# Altium schematic sheet BPC_PWR_MCU.schdoc: Eurocard VME 6U (9.187 x 6.299 inches)
size A3; Organization: Organization; Address1: Address1; Address2: Address2; Address3: Address3; Address4: Address4; DocumentNumber: 1; Revision: 0; SheetNumber: 4; SheetTotal: 5
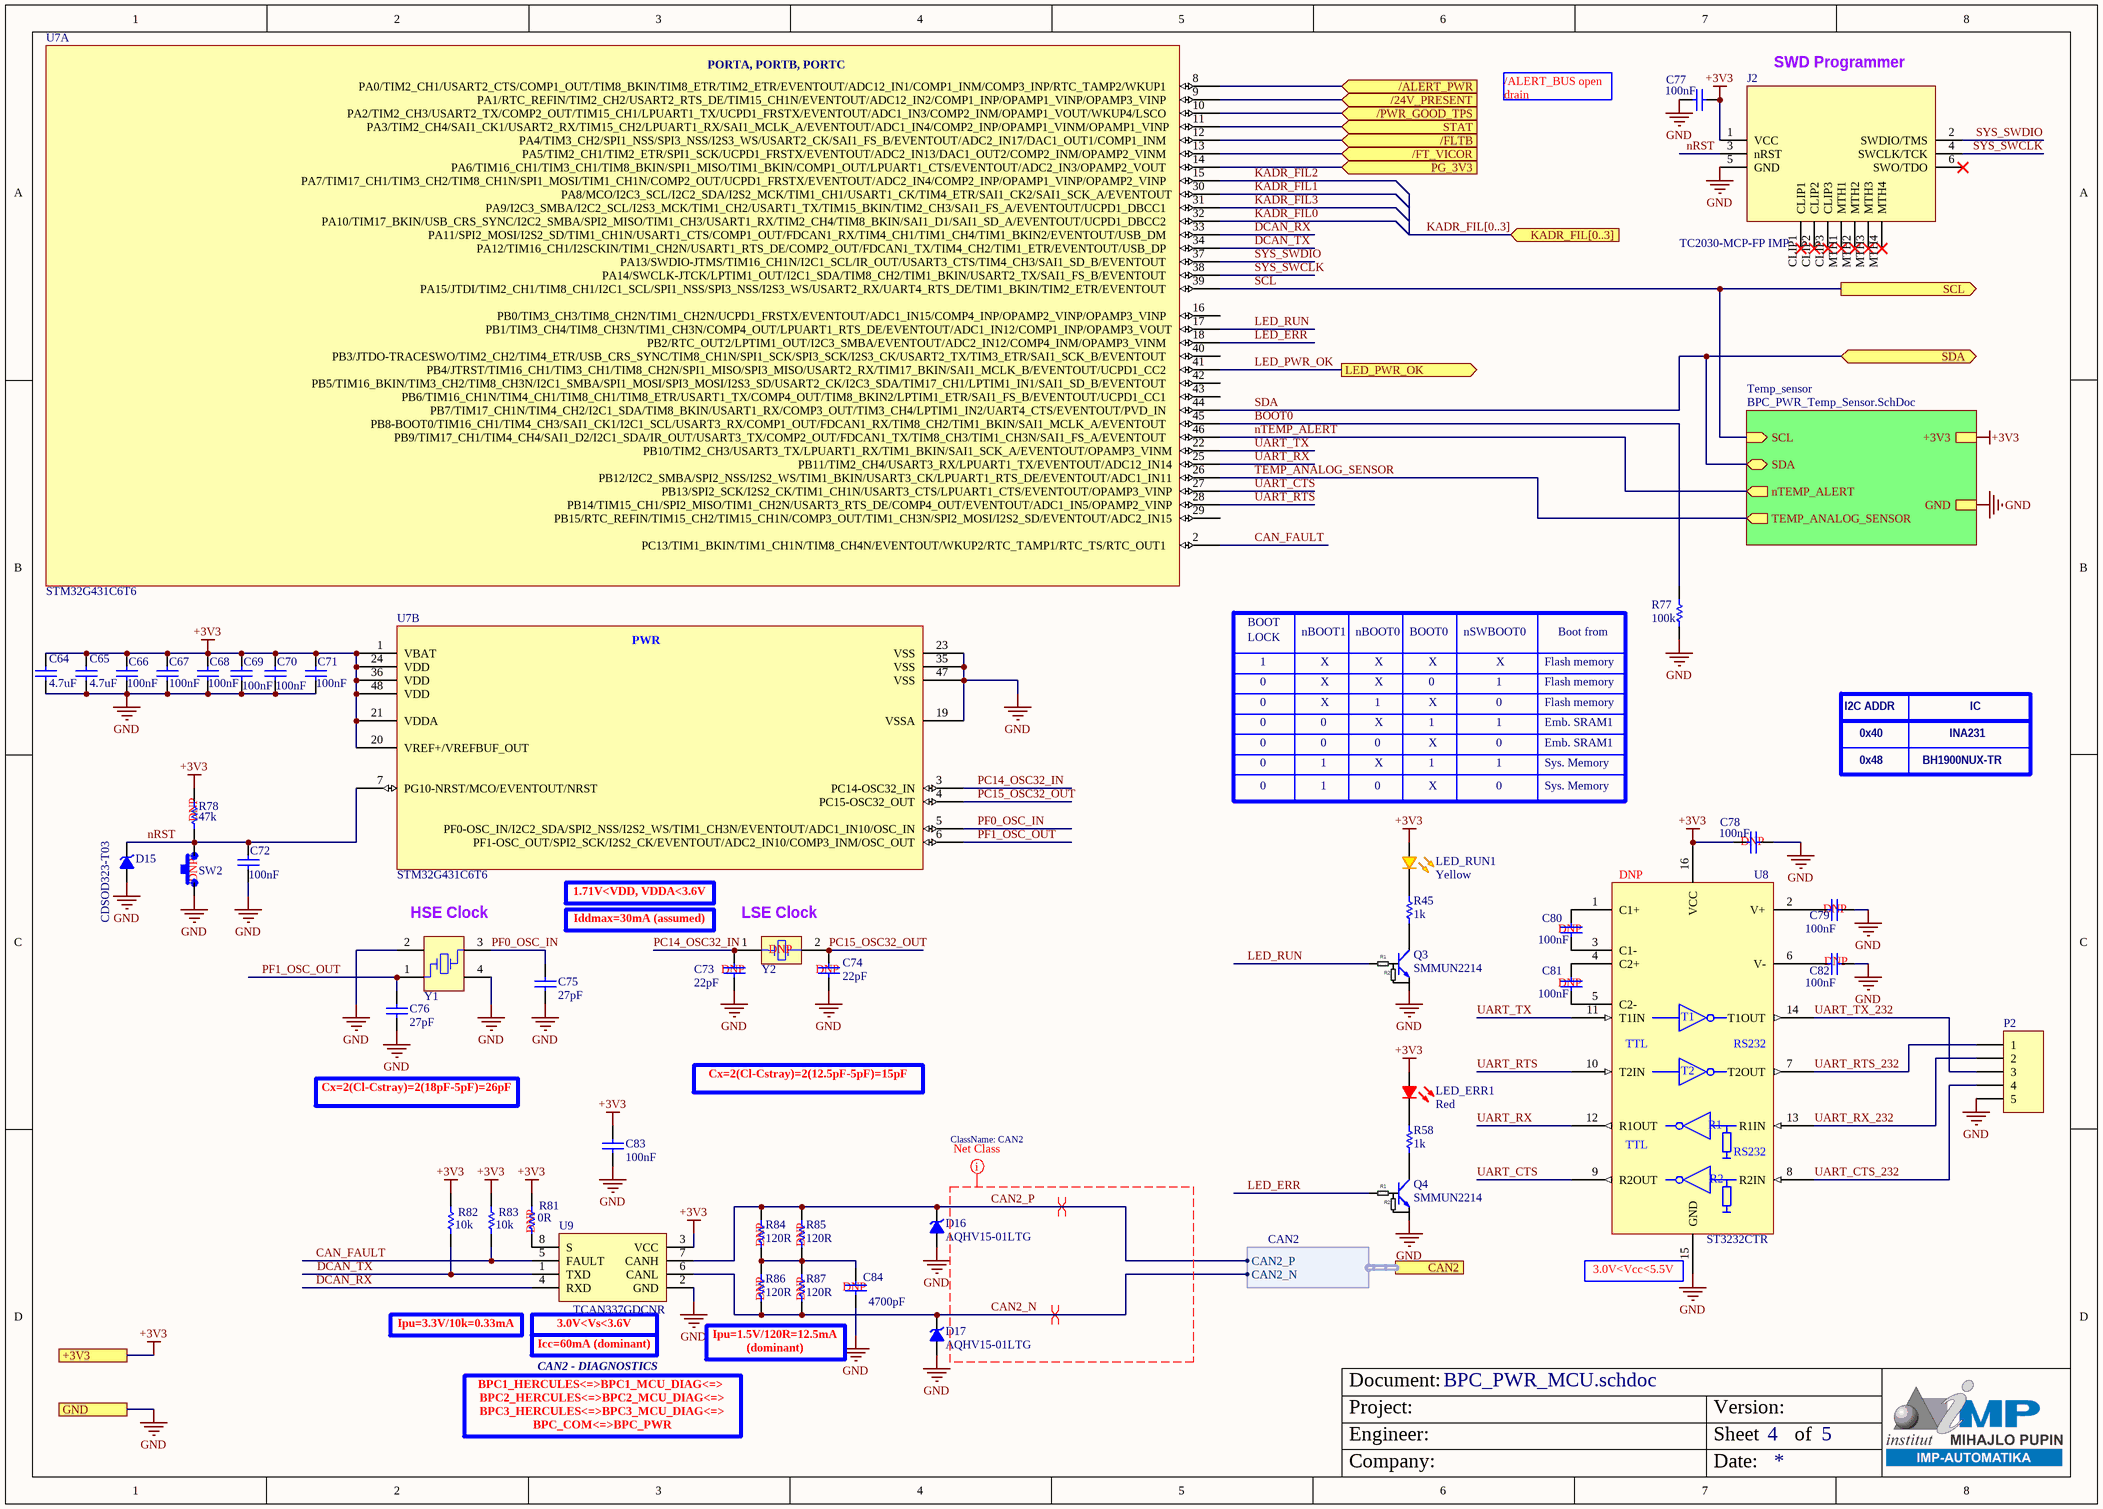
[diagram p0: BPC_PWR_MCU.schdoc]

## Parts
C64  DB Parameter 1: 4.7uF  [C0603L 0.8 MM MS]  (hidden comment: Ceramic Capacitor)
C65  DB Parameter 1: 4.7uF  [C0603L 0.8 MM MS]  (hidden comment: Ceramic Capacitor)
C66  Capacitance: 100nF  [C0603L 0.8 MM MS]  (hidden comment: Ceramic Capacitor)
C67  Capacitance: 100nF  [C0603L 0.8 MM MS]  (hidden comment: Ceramic Capacitor)
C68  Capacitance: 100nF  [C0603L 0.8 MM MS]  (hidden comment: Ceramic Capacitor)
C69  Capacitance: 100nF  [C0603L 0.8 MM MS]  (hidden comment: Ceramic Capacitor)
C70  Capacitance: 100nF  [C0603L 0.8 MM MS]  (hidden comment: Ceramic Capacitor)
C71  Capacitance: 100nF  [C0603L 0.8 MM MS]  (hidden comment: Ceramic Capacitor)
C72  Capacitance: 100nF  [C0603L 0.8 MM MS]  (hidden comment: Ceramic Capacitor)
C73  Populated: DNP  Capacitance: 22pF  [C0603L 0.8 MM MS]  (hidden comment: Ceramic Capacitor)
C74  Populated: DNP  Capacitance: 22pF  [C0603L 0.8 MM MS]  (hidden comment: Ceramic Capacitor)
C75  Capacitance: 27pF  [C0603L 0.8 MM MS]  (hidden comment: Ceramic Capacitor)
C76  Capacitance: 27pF  [C0603L 0.8 MM MS]  (hidden comment: Ceramic Capacitor)
C77  Capacitance: 100nF  [C0603L 0.8 MM MS]  (hidden comment: Ceramic Capacitor)
C78  Populated: DNP  Capacitance: 100nF  [C0603L 0.8 MM MS]  (hidden comment: Ceramic Capacitor)
C79  Populated: DNP  Capacitance: 100nF  [C0603L 0.8 MM MS]  (hidden comment: Ceramic Capacitor)
C80  Populated: DNP  Capacitance: 100nF  [C0603L 0.8 MM MS]  (hidden comment: Ceramic Capacitor)
C81  Populated: DNP  Capacitance: 100nF  [C0603L 0.8 MM MS]  (hidden comment: Ceramic Capacitor)
C82  Populated: DNP  Capacitance: 100nF  [C0603L 0.8 MM MS]  (hidden comment: Ceramic Capacitor)
C83  Capacitance: 100nF  [C0603L 0.8 MM MS]  (hidden comment: Ceramic Capacitor)
C84  Populated: DNP  Capacitance: 4700pF  [C0603L 0.8 MM MS]  (hidden comment: Ceramic Capacitor)
D15  CDSOD323-T03  [SOD2513X114N]
D16  AQHV15-01LTG  [AQHV1501LTGC SOD523 MS]
D17  AQHV15-01LTG  [AQHV1501LTGC SOD523 MS]
J2  TC2030-MCP-FP IMP  [TC2030-MCP-FP MS]
LED_ERR1  Red  [LED Red Mentor 2632.8320 x1]
LED_RUN1  Yellow  [LED Yellow Mentor 2632.8370 x1 MS]
P2  Header  [Header 1x5 2.54 12.4/3mm SL 11 124 5 G MS]  (value not drawn)
Q3  SMMUN2214  [SOT-23 MS]
Q4  SMMUN2214  [SOT-23 MS]
R45  Resistance: 1k  [R0603L 0.45MM MS]  (hidden comment: Resistor)
R58  Resistance: 1k  [R0603L 0.45MM MS]  (hidden comment: Resistor)
R77  Resistance: 100k  [R0603L 0.45MM MS]  (hidden comment: Resistor)
R78  Populated: DNP  Resistance: 47k  [R0603L 0.45MM MS]  (hidden comment: Resistor)
R81  Populated: DNP  Resistance: 0R  [R0603L 0.45MM MS]  (hidden comment: Resistor)
R82  Resistance: 10k  [R0603L 0.45MM MS]  (hidden comment: Resistor)
R83  Resistance: 10k  [R0603L 0.45MM MS]  (hidden comment: Resistor)
R84  Populated: DNP  Resistance: 120R  [0805 R 0.5mm MS]  (hidden comment: Resistor)
R85  Populated: DNP  Resistance: 120R  [0805 R 0.5mm MS]  (hidden comment: Resistor)
R86  Populated: DNP  Resistance: 120R  [0805 R 0.5mm MS]  (hidden comment: Resistor)
R87  Populated: DNP  Resistance: 120R  [0805 R 0.5mm MS]  (hidden comment: Resistor)
SW2  Populated: DNP  [ADTSM3 MS]  (hidden comment: Tactile Switch)
U7  STM32G431C6T6  [LQFP48-7x7mm MS]  (parts A,B of 2)
U8  Populated: DNP  [TSSOP16_STM MS]  (hidden comment: ST3232CTR)
U9  TCAN337GDCNR  [SOT65P280X110-8N]
Y1  Crystal  [ABMM2]  (value not drawn)
Y2  Populated: DNP  [ABS07W32768kHzD2T]  (hidden comment: Crystal)

## Sub-sheets
Temp_sensor = BPC_PWR_Temp_Sensor.SchDoc: GND, +3V3, nTEMP_ALERT (out), TEMP_ANALOG_SENSOR (out), SDA (bidir), SCL (in)

## Ports
+3V3, /24V_PRESENT (in), /ALERT_PWR (in), /FLTB (in), /FT_VICOR (in), /PWR_GOOD_TPS (in), CAN2 (harness CAN2), GND, KADR_FIL[0..3] (in), LED_PWR_OK (out), PG_3V3 (in), SCL (out), SDA (bidir), STAT (in)

## Harnesses
CAN2: CAN2_N, CAN2_P

## Nets
+3V3: C64.1 C65.1 C66.2 C67.2 C68.2 C69.2 C70.2 C71.2 C77.1 C78.2 C83.1 J2.1(VCC) LED_ERR1.A LED_RUN1.A R78.2 R81.2 R82.1 R83.1 U7.1(VBAT) U7.20(VREF+/VREFBUF_OUT) U7.21(VDDA) U7.24(VDD) U7.36(VDD) U7.48(VDD) U8.16(VCC) U9.3(VCC) ; port +3V3, sheet Temp_sensor/+3V3
GND: C64.2 C65.2 C66.1 C67.1 C68.1 C69.1 C70.1 C71.1 C72.1 C73.2 C74.2 C75.2 C76.2 C77.2 C78.1 C79.1 C82.1 C83.2 C84.2 D15.A D16.2(A) D17.2(A) J2.5(GND) P2.5 Q3.2 Q4.2 R77.2 SW2.1 U7.19(VSSA) U7.23(VSS) U7.35(VSS) U7.47(VSS) U8.15(GND) U9.2(GND) Y1.2(COM) Y1.4(OSC2) ; port GND, sheet Temp_sensor/GND
/24V_PRESENT: U7.9(PA1/RTC_REFIN/TIM2_CH2/USART2_RTS_DE/TIM15_CH1N/EVENTOUT/ADC12_IN2/COMP1_INP/OPAMP1_VINP/OPAMP3_VINP) ; port /24V_PRESENT
/ALERT_PWR: U7.8(PA0/TIM2_CH1/USART2_CTS/COMP1_OUT/TIM8_BKIN/TIM8_ETR/TIM2_ETR/EVENTOUT/ADC12_IN1/COMP1_INM/COMP3_INP/RTC_TAMP2/WKUP1) ; port /ALERT_PWR
/FLTB: U7.12(PA4/TIM3_CH2/SPI1_NSS/SPI3_NSS/I2S3_WS/USART2_CK/SAI1_FS_B/EVENTOUT/ADC2_IN17/DAC1_OUT1/COMP1_INM) ; port /FLTB
/FT_VICOR: U7.13(PA5/TIM2_CH1/TIM2_ETR/SPI1_SCK/UCPD1_FRSTX/EVENTOUT/ADC2_IN13/DAC1_OUT2/COMP2_INM/OPAMP2_VINM) ; port /FT_VICOR
/PWR_GOOD_TPS: U7.10(PA2/TIM2_CH3/USART2_TX/COMP2_OUT/TIM15_CH1/LPUART1_TX/UCPD1_FRSTX/EVENTOUT/ADC1_IN3/COMP2_INM/OPAMP1_VOUT/WKUP4/LSCO) ; port /PWR_GOOD_TPS
BOOT0: R77.1 U7.45(PB8-BOOT0/TIM16_CH1/TIM4_CH3/SAI1_CK1/I2C1_SCL/USART3_RX/COMP1_OUT/FDCAN1_RX/TIM8_CH2/TIM1_BKIN/SAI1_MCLK_A/EVENTOUT)
CAN2_N: D17.1(K) R86.1 R87.1 U9.6(CANL) ; port CAN2.CAN2_N
CAN2_P: D16.1(K) R84.2 R85.2 U9.7(CANH) ; port CAN2.CAN2_P
CAN_FAULT: R83.2 U7.2(PC13/TIM1_BKIN/TIM1_CH1N/TIM8_CH4N/EVENTOUT/WKUP2/RTC_TAMP1/RTC_TS/RTC_OUT1) U9.5(FAULT)
DCAN_RX: U7.33(PA11/SPI2_MOSI/I2S2_SD/TIM1_CH1N/USART1_CTS/COMP1_OUT/FDCAN1_RX/TIM4_CH1/TIM1_CH4/TIM1_BKIN2/EVENTOUT/USB_DM) U9.4(RXD)
DCAN_TX: R82.2 U7.34(PA12/TIM16_CH1/I2SCKIN/TIM1_CH2N/USART1_RTS_DE/COMP2_OUT/FDCAN1_TX/TIM4_CH2/TIM1_ETR/EVENTOUT/USB_DP) U9.1(TXD)
KADR_FIL0: U7.32(PA10/TIM17_BKIN/USB_CRS_SYNC/I2C2_SMBA/SPI2_MISO/TIM1_CH3/USART1_RX/TIM2_CH4/TIM8_BKIN/SAI1_D1/SAI1_SD_A/EVENTOUT/UCPD1_DBCC2)
KADR_FIL1: U7.30(PA8/MCO/I2C3_SCL/I2C2_SDA/I2S2_MCK/TIM1_CH1/USART1_CK/TIM4_ETR/SAI1_CK2/SAI1_SCK_A/EVENTOUT)
KADR_FIL2: U7.15(PA7/TIM17_CH1/TIM3_CH2/TIM8_CH1N/SPI1_MOSI/TIM1_CH1N/COMP2_OUT/UCPD1_FRSTX/EVENTOUT/ADC2_IN4/COMP2_INP/OPAMP1_VINP/OPAMP2_VINP)
KADR_FIL3: U7.31(PA9/I2C3_SMBA/I2C2_SCL/I2S3_MCK/TIM1_CH2/USART1_TX/TIM15_BKIN/TIM2_CH3/SAI1_FS_A/EVENTOUT/UCPD1_DBCC1)
LED_ERR: Q4.1 U7.18(PB2/RTC_OUT2/LPTIM1_OUT/I2C3_SMBA/EVENTOUT/ADC2_IN12/COMP4_INM/OPAMP3_VINM)
LED_PWR_OK: U7.41(PB4/JTRST/TIM16_CH1/TIM3_CH1/TIM8_CH2N/SPI1_MISO/SPI3_MISO/USART2_RX/TIM17_BKIN/SAI1_MCLK_B/EVENTOUT/UCPD1_CC2) ; port LED_PWR_OK
LED_RUN: Q3.1 U7.17(PB1/TIM3_CH4/TIM8_CH3N/TIM1_CH3N/COMP4_OUT/LPUART1_RTS_DE/EVENTOUT/ADC1_IN12/COMP1_INP/OPAMP3_VOUT)
nRST: C72.2 D15.K J2.3(nRST) R78.1 SW2.2 U7.7(PG10-NRST/MCO/EVENTOUT/NRST)
nTEMP_ALERT: U7.46(PB9/TIM17_CH1/TIM4_CH4/SAI1_D2/I2C1_SDA/IR_OUT/USART3_TX/COMP2_OUT/FDCAN1_TX/TIM8_CH3/TIM1_CH3N/SAI1_FS_A/EVENTOUT) ; sheet Temp_sensor/nTEMP_ALERT
PC14_OSC32_IN: C73.1 U7.3(PC14-OSC32_IN) Y2.1(OSC1)
PC15_OSC32_OUT: C74.1 U7.4(PC15-OSC32_OUT) Y2.2(COM)
PF0_OSC_IN: C75.1 U7.5(PF0-OSC_IN/I2C2_SDA/SPI2_NSS/I2S2_WS/TIM1_CH3N/EVENTOUT/ADC1_IN10/OSC_IN) Y1.3(COM)
PF1_OSC_OUT: C76.1 U7.6(PF1-OSC_OUT/SPI2_SCK/I2S2_CK/EVENTOUT/ADC2_IN10/COMP3_INM/OSC_OUT) Y1.1(OSC1)
PG_3V3: U7.14(PA6/TIM16_CH1/TIM3_CH1/TIM8_BKIN/SPI1_MISO/TIM1_BKIN/COMP1_OUT/LPUART1_CTS/EVENTOUT/ADC2_IN3/OPAMP2_VOUT) ; port PG_3V3
SCL: U7.39(PA15/JTDI/TIM2_CH1/TIM8_CH1/I2C1_SCL/SPI1_NSS/SPI3_NSS/I2S3_WS/USART2_RX/UART4_RTS_DE/TIM1_BKIN/TIM2_ETR/EVENTOUT) ; port SCL, sheet Temp_sensor/SCL
SDA: U7.44(PB7/TIM17_CH1N/TIM4_CH2/I2C1_SDA/TIM8_BKIN/USART1_RX/COMP3_OUT/TIM3_CH4/LPTIM1_IN2/UART4_CTS/EVENTOUT/PVD_IN) ; port SDA, sheet Temp_sensor/SDA
STAT: U7.11(PA3/TIM2_CH4/SAI1_CK1/USART2_RX/TIM15_CH2/LPUART1_RX/SAI1_MCLK_A/EVENTOUT/ADC1_IN4/COMP2_INP/OPAMP1_VINM/OPAMP1_VINP) ; port STAT
SYS_SWCLK: J2.4(SWCLK/TCK) U7.38(PA14/SWCLK-JTCK/LPTIM1_OUT/I2C1_SDA/TIM8_CH2/TIM1_BKIN/USART2_TX/SAI1_FS_B/EVENTOUT)
SYS_SWDIO: J2.2(SWDIO/TMS) U7.37(PA13/SWDIO-JTMS/TIM16_CH1N/I2C1_SCL/IR_OUT/USART3_CTS/TIM4_CH3/SAI1_SD_B/EVENTOUT)
TEMP_ANALOG_SENSOR: U7.26(PB12/I2C2_SMBA/SPI2_NSS/I2S2_WS/TIM1_BKIN/USART3_CK/LPUART1_RTS_DE/EVENTOUT/ADC1_IN11) ; sheet Temp_sensor/TEMP_ANALOG_SENSOR
UART_CTS: U7.27(PB13/SPI2_SCK/I2S2_CK/TIM1_CH1N/USART3_CTS/LPUART1_CTS/EVENTOUT/OPAMP3_VINP) U8.9(R2OUT)
UART_CTS_232: P2.4 U8.8(R2IN)
UART_RTS: U7.28(PB14/TIM15_CH1/SPI2_MISO/TIM1_CH2N/USART3_RTS_DE/COMP4_OUT/EVENTOUT/ADC1_IN5/OPAMP2_VINP) U8.10(T2IN)
UART_RTS_232: P2.1 U8.7(T2OUT)
UART_RX: U7.25(PB11/TIM2_CH4/USART3_RX/LPUART1_TX/EVENTOUT/ADC12_IN14) U8.12(R1OUT)
UART_RX_232: P2.2 U8.13(R1IN)
UART_TX: U7.22(PB10/TIM2_CH3/USART3_TX/LPUART1_RX/TIM1_BKIN/SAI1_SCK_A/EVENTOUT/OPAMP3_VINM) U8.11(T1IN)
UART_TX_232: P2.3 U8.14(T1OUT)
NetC79_2: C79.2 U8.2(V+)
NetC80_1: C80.1 U8.3(C1-)
NetC80_2: C80.2 U8.1(C1+)
NetC81_1: C81.1 U8.5(C2-)
NetC81_2: C81.2 U8.4(C2+)
NetC82_2: C82.2 U8.6(V-)
NetC84_1: C84.1 R84.1 R85.1 R86.2 R87.2
NetLED_ERR1_K: LED_ERR1.K R58.2
NetLED_RUN1_K: LED_RUN1.K R45.2
NetQ3_3: Q3.3 R45.1
NetQ4_3: Q4.3 R58.1
NetR81_1: R81.1 U9.8(S)

Not connected (* = marked no-connect by the designer): J2 6(SWO/TDO)* CLIP1* CLIP2* CLIP3* MTH1* MTH2* MTH3* MTH4*; U7 16(PB0/TIM3_CH3/TIM8_CH2N/TIM1_CH2N/UCPD1_FRSTX/EVENTOUT/ADC1_IN15/COMP4_INP/OPAMP2_VINP/OPAMP3_VINP__) 29(PB15/RTC_REFIN/TIM15_CH2/TIM15_CH1N/COMP3_OUT/TIM1_CH3N/SPI2_MOSI/I2S2_SD/EVENTOUT/ADC2_IN15) 40(PB3/JTDO-TRACESWO/TIM2_CH2/TIM4_ETR/USB_CRS_SYNC/TIM8_CH1N/SPI1_SCK/SPI3_SCK/I2S3_CK/USART2_TX/TIM3_ETR/SAI1_SCK_B/EVENTOUT__) 42(PB5/TIM16_BKIN/TIM3_CH2/TIM8_CH3N/I2C1_SMBA/SPI1_MOSI/SPI3_MOSI/I2S3_SD/USART2_CK/I2C3_SDA/TIM17_CH1/LPTIM1_IN1/SAI1_SD_B/EVENTOUT__) 43(PB6/TIM16_CH1N/TIM4_CH1/TIM8_CH1/TIM8_ETR/USART1_TX/COMP4_OUT/TIM8_BKIN2/LPTIM1_ETR/SAI1_FS_B/EVENTOUT/UCPD1_CC1__)

## Buses and harness runs
bus KADR_FIL[0..3] = port KADR_FIL[0..3]

## Layout directives
differential pair: CAN2_N, CAN2_P
net class CAN2: CAN2_N, CAN2_P

## Notes on the sheet
- /ALERT_BUS open drain
- SWD Programmer
- BOOT
- LOCK
- nBOOT1
- nBOOT0
- BOOT0
- nSWBOOT0
- Boot from
- 1
- 0
- X
- Flash memory
- I2C ADDR
- IC
- Emb. SRAM1
- Sys. Memory
- 0x40
- 0x48
- BH1900NUX-TR
- INA231
- (near Y1) HSE Clock
- 1.71V<VDD, VDDA<3.6V
- LSE Clock
- Iddmax=30mA (assumed)
- Cx=2(Cl-Cstray)=2(18pF-5pF)=26pF
- Cx=2(Cl-Cstray)=2(12.5pF-5pF)=15pF
- (near U8) 3.0V<Vcc<5.5V
- (near U9) Ipu=3.3V/10k=0.33mA (dominant)
- (near U9) 3.0V<Vs<3.6V
- (near U9) Icc=60mA (dominant)
- CAN2 - DIAGNOSTICS
- Ipu=1.5V/120R=12.5mA (dominant)
- BPC1_HERCULES<=>BPC1_MCU_DIAG<=>
  BPC2_HERCULES<=>BPC2_MCU_DIAG<=>
  BPC3_HERCULES<=>BPC3_MCU_DIAG<=>
  BPC_COM<=>BPC_PWR
  BPC2<=>BPC3<=>BPC_COM<=> BPC_PWR
- Document:
- Project:
- Engineer:
- Version:
- Sheet
- of
- Company:
- Date:
- (in symbol IC MCU STM32G431C6T6 MS, part A) PORTA, PORTB, PORTC
- (in symbol IC MCU STM32G431C6T6 MS, part B) PWR
- (in symbol IC ST3232CTR MS) T1; TTL; RS232; T2; R1; R2
- (in symbol Tra NPN Prebias MS) R1; R2

## Library data of the parts
C64 C65 = Cap Cer 4.7uF 10V X5R 0603 MS: Ceramic Capacitor 4.7uF 10V X5R 0603; Manufacturer: Samsung Electro-Mechanics; Manufacturer Part Number: CL10A475KP8NNNC; Tolerance: ±10%; Production Status: Active; Distributor: Mouser; Distributor Part Number: 187-CL10A475KP8NNNC; Last Revision Date: 19.10.2020.; Temperature Range: -55°C ~ +85°C; Mounting: SMD; ComponentLink1Description: Datasheet; ComponentLink1URL: https://eu.mouser.com/datasheet/2/585/MLCC-1837944.pdf; ComponentLink2Description: Distributor; ComponentLink2URL: https://eu.mouser.com/ProductDetail/Samsung-Electro-Mechanics/CL10A475KP8NNNC?qs=hqM3L16%252BxlfQRmkWsZz5vA%3D%3D; ComponentLink3Description: Manufacturer; ComponentLink3URL: http://product.samsungsem.com/mlcc/basic-search.do?partNumber=CL10A475KP8NNN; Status: Not Checked; Voltage: 10V; Dielectric: X5R; ComponentLink4Description: Charts; ComponentLink4URL: http://weblib.samsungsem.com/mlcc/mlcc-ec-data-sheet.do?partNumber=CL10A475KP8NNN; Capacitance: 4.7uF; DB Parameter 2: 10V; DB Parameter 3: X5R
C66-C72 C77-C83 = Cap Cer 100nF 50V X7R 0603 Pt02: Ceramic Capacitor 100nF 50V X7R 0603; Manufacturer: Samsung Electro-Mechanics; Manufacturer Part Number: CL10B104KB8WPNC; Tolerance: ±10%; Distributor: Mouser; Distributor Part Number: 187-CL10B104KB8WPNC; Last Revision Date: 19.10.2020.; Temperature Range: -55°C ~ +125°C; Mounting: SMD; ComponentLink1Description: Datasheet; ComponentLink1URL: https://eu.mouser.com/datasheet/2/396/mlcc02_e-1307760.pdf; ComponentLink2Description: Distributor; ComponentLink2URL: https://eu.mouser.com/ProductDetail/Taiyo-Yuden/JMK212BJ476MG-T?qs=I6KAKw0tg2zBfYZ1Prs1hQ%3D%3D; ComponentLink3Description: Manufacturer; ComponentLink3URL: https://ds.yuden.co.jp/TYCOMPAS/or/detail?pn=JMK212BBJ476MG-T&u=M; Status: Not Checked; Voltage: 50V; Dielectric: X7R; ComponentLink4Description: Charts; DB Parameter 1: 100nF; DB Parameter 2: 50V; DB Parameter 3: X7R
C73 C74 = Cap Cer 22pF 50V C0G_NP0 0603 MS: Ceramic Capacitor 22pF 50V C0G_NP0 0603; Manufacturer: AVX Corporation; Manufacturer Part Number: 06035A220JAT2A; Tolerance: ±5%; Dielectric: C0G, NP0; Production Status: Active; Distributor: Digi-Key; Distributor Part Number: 478-1167-1-ND; Last Revision Date: 13.07.2021; Temperature Range: -55°C ~ +125°C; Mounting: SMD; ComponentLink1Description: Datasheet; ComponentLink1URL: https://datasheets.avx.com/C0GNP0-Dielectric.pdf; ComponentLink2Description: Distributor; ComponentLink2URL: https://www.digikey.com/en/products/detail/avx-corporation/06035A220JAT2A/563277; ComponentLink3Description: Manufacturer; ComponentLink3URL: https://spicat.avx.com/product/mlcc/chartview/06035A220JAT2A/dist/mouser; Status: Not Checked; Voltage: 50V; ComponentLink4Description: Charts; ComponentLink4URL: https://spicat.avx.com/product/mlcc/chartview/06035A220JAT2A/dist/mouser; DB Parameter 1: 22pF; DB Parameter 2: 50V; DB Parameter 3: C0G, NP0
C75 C76 = Cap Cer 27pF 50V C0G_NP0 0603 MS: Ceramic Capacitor 27pF 50V C0G_NP0 0603; Manufacturer: Yageo; Manufacturer Part Number: CC0603JRNPO9BN270; Tolerance: ±5%; Dielectric: C0G, NP0; Production Status: Active; Distributor: Digi-Key; Distributor Part Number: 311-1063-1-ND; Last Revision Date: 07.06.2021; Temperature Range: -55°C ~ +125°C; Mounting: SMD; ComponentLink1Description: Datasheet; ComponentLink1URL: https://www.yageo.com/upload/media/product/productsearch/datasheet/mlcc/UPY-GP_NP0_16V-to-50V_18.pdf; ComponentLink2Description: Distributor; ComponentLink2URL: https://www.digikey.com/en/products/detail/yageo/CC0603JRNPO9BN270/302797; ComponentLink3Description: Manufacturer; ComponentLink3URL: https://www.yageo.com/en/ProductSearch/PartNumberSearch?part_number=CC0603JRNPO9BN270; Status: Not Checked; Voltage: 50V; ComponentLink4Description: Charts; ComponentLink4URL: https://www.yageo.com/en/Chart/Index/CC0603JRNPO9BN270#chart_cap_freq; DB Parameter 1: 27pF; DB Parameter 2: 50V; DB Parameter 3: C0G, NP0
C84 = Cap Cer 4700pF 50V C0G_NP0 0603 MS: Ceramic Capacitor 4700pF 50V C0G_NP0 0603; Manufacturer: TDK Corporation; Manufacturer Part Number: CGA3E2C0G1H472J080AA; Tolerance: ±5%; Dielectric: C0G, NP0; Production Status: Active; Distributor: Digi-Key; Distributor Part Number: 445-6912-1-ND; Last Revision Date: 26.06.2021; Temperature Range: -55°C ~ +125°C; Mounting: SMD; ComponentLink1Description: Datasheet; ComponentLink1URL: https://product.tdk.com/en/system/files?file=dam/doc/product/capacitor/ceramic/mlcc/catalog/mlcc_automotive_general_en.pdf; ComponentLink2Description: Distributor; ComponentLink2URL: https://www.digikey.com/en/products/detail/tdk-corporation/CGA3E2C0G1H472J080AA/2672805; ComponentLink3Description: Manufacturer; ComponentLink3URL: https://product.tdk.com/en/search/capacitor/ceramic/mlcc/info?part_no=CGA3E2C0G1H472J080AA; Status: Not Checked; Voltage: 50V; ComponentLink4Description: Charts; ComponentLink4URL: https://product.tdk.com/system/files/dam/doc/product/capacitor/ceramic/mlcc/charasheet/cga3e2c0g1h472j080aa.pdf; DB Parameter 1: 4700pF; DB Parameter 2: 50V; DB Parameter 3: C0G, NP0
D15 = Dio TVS Udir 3.3V 19V CDSOD323 MS: TVS Diode 3.3V 19V Udir; Manufacturer: Bourns Inc.; Peak Pulse Power: 350W; Production status: Active; Distributor: Digi-Key; Distributor Part Number: CDSOD323-T03CT-ND; Manufacturer Part Number: CDSOD323-T03; Last Revision Date: 29.03.2021; Temperature Range: -55°C ~ +155°C; Mounting: SMD; ComponentLink1Description: Datasheet; ComponentLink1URL: https://www.bourns.com/docs/Product-Datasheets/CDSOD323-TxxC.pdf; ComponentLink2Description: Distributor; ComponentLink2URL: https://www.digikey.com/en/products/detail/bourns-inc/CDSOD323-T03/3742076; ComponentLink3Description: Manufacturer; ComponentLink3URL: https://www.bourns.com/docs/Product-Datasheets/CDSOD323-TxxC.pdf; Status: Not Checked; Working Voltage: 3.3V; DB Parameter 1: 3.3V; DB Parameter 2: 19V; DB Parameter 3: 350W; Clamping Voltage: 19V
D16 D17 = Dio TVS Udir 15V 250W AQHV15-01LTG MS: TVS Diode 15V 300W Unidirectional; Manufacturer: Littelfuse Inc.; Peak Pulse Power: 250W; DB Parameter 1: 18.7V; DB Parameter 2: 21.5V; Production status: Active; Distributor: Mouser; Distributor Part Number: 576-AQHV15-01LTG; Manufacturer Part Number: AQHV15-01LTG; Last Revision Date: 09.06.2022; Temperature Range: -40°C ~ +150°C; Mounting: SMD; ComponentLink1Description: Datasheet; ComponentLink1URL: https://www.littelfuse.com/~/media/electronics/datasheets/tvs_diode_arrays/littelfuse_tvs_diode_array_aqhvxx_01ltg_datasheet.pdf.pdf; ComponentLink2Description: Distributor; ComponentLink2URL: https://eu.mouser.com/ProductDetail/Littelfuse/AQHV15-01LTG?qs=qSfuJ%252Bfl%2Fd4j4uT4lsIC5w%3D%3D; ComponentLink3Description: Manufacturer; ComponentLink3URL: https://www.littelfuse.com/~/media/electronics/datasheets/tvs_diode_arrays/littelfuse_tvs_diode_array_aqhvxx_01ltg_datasheet.pdf.pdf; Status: Not Checked; Working Voltage: 15V; DB Parameter 3: 250W; Clamping Voltage: 21.5V
J2 = Prog TC2030-MCP-FP IMP MS: PCB DECAL: TC2030-MCP-FP
LED_ERR1 = LED Mentor 2632.8320 Red x1 MS: LED Mentor 2632.8320 Red x1; Manufacturer Part Number: 2632.8320 1/8; Forward Current: 25mA; Luminous Intensity: 1.2 - 4 mcd; Forward Voltage: 2.25V; DB Parameter 3: 700nm; Production Status: Active; Distributor: Mentor; Distributor Part Number: 2632.8320 1/8; Manufacturer: Mentor; Last Revision Date: 17.03.2021; Temperature Range: -40°C ~ +85°C; Mounting: TH; ComponentLink1Description: Datasheet; ComponentLink1URL: https://www.mentor.de.com/productpdfs/opto/1145.pdf; ComponentLink2Description: Distributor; ComponentLink2URL: https://www.mentor.de.com/bauelemente/en/product/en-2632-8320/; ComponentLink3Description: Manufacturer; ComponentLink3URL: https://www.mentor.de.com/bauelemente/en/product/en-2632-8320/; Status: Not Checked; DB Parameter 1: Red; DB Parameter 2: 2.25V; LED Color: Red
LED_RUN1 = LED Mentor 2632.8370 Yellow x1 MS: LED Mentor 2632.8370 Yellow x1; Manufacturer Part Number: 2632.8370 1/8; Forward Current: 25mA; Luminous Intensity: 10 - 20 mcd; Forward Voltage: 2.1V; DB Parameter 3: 588nm; Production Status: Active; Distributor: Mentor; Distributor Part Number: 2632.8370 1/8; Manufacturer: Mentor; Last Revision Date: 31.08.2021; Temperature Range: -40°C ~ +85°C; Mounting: TH; ComponentLink1Description: Datasheet; ComponentLink1URL: https://www.mentor.de.com/productpdfs/opto/1145.pdf; ComponentLink2Description: Distributor; ComponentLink2URL: https://www.mentor.de.com/bauelemente/en/product/en-2632-8320/; ComponentLink3Description: Manufacturer; ComponentLink3URL: https://www.mentor.de.com/bauelemente/en/product/en-2632-8320/; Status: Not Checked; DB Parameter 1: Yellow; DB Parameter 2: 2.1V; LED Color: Yellow
P2 = Con Header 1x5 2.54 12.4/3mm Fischer SL 11 124 5 G: Header 1x5 2.54 12.4/3mm; Manufacturer: Fischer Elektronik; Rated Current: 3A; Distributor: Fischer Elektronik; Distributor Part Number: SL 11 124 5 G; Manufacturer Part Number: SL 11 124 5 G; Last Revision Date: 17.07.2020.; Temperature Range: -40°C ~ +163°C; Mounting: TH; ComponentLink1Description: Datasheet; ComponentLink1URL: https://www.fischerelektronik.com/web_fischer/en_GB/connectors/G01/Male%20headers/VA/SL111245G/index.xhtml; ComponentLink2Description: Distributor; ComponentLink2URL: https://www.fischerelektronik.com/web_fischer/en_GB/connectors/G01/Male%20headers/VA/SL111245G/index.xhtml; ComponentLink3Description: Manufacturer; ComponentLink3URL: https://www.fischerelektronik.com/web_fischer/en_GB/connectors/G01/Male%20headers/VA/SL111245G/index.xhtml; Status: Checked
Q3 Q4 = Tra NPN Prebias MS: TRANS PREBIAS NPN 50V SOT23; Manufacturer: ON Semiconductor; Manufacturer Part Number: SMMUN2214LT1G; Ic Max: 100mA; Resistor Base: 10k; Resistor Emitter Base: 47k; hFE Min: 80; Production Status: Active; Power Rating: 246mW; Vces: 0.25V; Distributor: Digi-Key; Distributor Part Number: SMMUN2214LT1GOSCT-ND; Last Revision Date: 29.07.2021; Temperature Range: -55°C ~ +150°C; Vcebo: 50V; Mounting: SMD; DB Parameter 1: 10k; DB Parameter 2: 47k; DB Parameter 3: 100mA; ComponentLink1Description: Datasheet; ComponentLink1URL: https://www.onsemi.com/pdf/datasheet/dtc114y-d.pdf; ComponentLink2Description: Distributor; ComponentLink2URL: https://www.digikey.com/en/products/detail/on-semiconductor/SMMUN2214LT1G/3062798; ComponentLink3Description: Manufacturer; ComponentLink3URL: https://www.onsemi.com/products/discretes-drivers/digital-transistors-brts/mmun2214l
R45 R58 = Res 1k 1% 125mW 0603: Resistor 1k 1% 125mW 0603; Manufacturer: Vishay Beyschlag/Draloric/BC Components; Manufacturer Part Number: MCT06030C1001FP500; Temperature Coefficient: ±50 PPM/°C; Production Status: Active; Distributor: Digi-Key; Distributor Part Number: MCT0603-1.00K-CFCT-ND; Last Revision Date: 22.10.2020.; Temperature Range: -55°C ~ +155°C; Mounting: SMD; ComponentLink1Description: Datasheet; ComponentLink1URL: https://www.vishay.com/docs/28705/mcx0x0xpro.pdf; ComponentLink2Description: Distributor; ComponentLink2URL: https://www.digikey.com/en/products/detail/vishay-beyschlag-draloric-bc-components/MCT06030C1001FP500/2607821; ComponentLink3Description: Manufacturer; ComponentLink3URL: https://www.vishay.com/search?query=MCT06030C1001FP500&searchChoice=part; Status: Not Checked; Power Rating: 125mW; Tolerance: ±1%; DB Parameter 2: ±1%; DB Parameter 3: 125mW; DB Parameter 1: 1k
R77 = Res 100k 1% 100mW 0603 Pt02: Resistor 100k 1% 100mW 0603; Manufacturer: Stackpole Electronics Inc; Manufacturer Part Number: RMCF0603FT100K; Temperature Coefficient: ±100ppm/°C; Production Status: Active; Distributor: Digi-Key; Distributor Part Number: RMCF0603FT100KCT-ND; Last Revision Date: 28.10.2020; Temperature Range: -55°C ~ +155°C; Mounting: SMD; ComponentLink1Description: Datasheet; ComponentLink1URL: https://www.seielect.com/catalog/sei-rmcf_rmcp.pdf; ComponentLink2Description: Distributor; ComponentLink2URL: https://www.digikey.com/en/products/detail/stackpole-electronics-inc/RMCF0603FT100K/1761112; ComponentLink3Description: Manufacturer; ComponentLink3URL: https://www.seielect.com/; Status: Not Checked; Power Rating: 100mW; Tolerance: ±1%; DB Parameter 1: 100k; DB Parameter 2: ±1%; DB Parameter 3: 100mW
R78 = Res 47k 1% 100mW 0603 MS: Resistor 47k 1% 100mW 0603; Manufacturer: Yageo; Manufacturer Part Number: RT0603FRE0747KL; Temperature Coefficient: ±50ppm/°C; Production Status: Active; Distributor: Digi-Key; Distributor Part Number: YAG3355CT-ND; Last Revision Date: 08.06.2021; Temperature Range: -55°C ~ +155°C; Mounting: SMD; ComponentLink1Description: Datasheet; ComponentLink1URL: https://www.yageo.com/upload/media/product/productsearch/datasheet/rchip/PYu-RT_1-to-0.01_RoHS_L_12.pdf; ComponentLink2Description: Distributor; ComponentLink2URL: https://www.digikey.com/en/products/detail/yageo/RT0603FRE0747KL/1075386; ComponentLink3Description: Manufacturer; ComponentLink3URL: https://www.yageo.com/en/ProductSearch/PartNumberSearch?part_number=RT0603FRE0747KL; Status: Not Checked; Power Rating: 100mW; Tolerance: ±1%; DB Parameter 1: 47k; DB Parameter 2: ±1%; DB Parameter 3: 100mW
R81 = Res 0R 100mW 0603: Resistor  0R 100mW 0603; Manufacturer: Stackpole Electronics Inc; Manufacturer Part Number: RMCF0603ZT0R00; DB Parameter 2: 1A; Production Status: Active; Maximum Current: 2A; Distributor: Digi-Key; Distributor Part Number: RMCF0603ZT0R00CT-ND; Last Revision Date: 20.10.2020.; Temperature Range: -55°C ~ +155°C; Mounting: SMD; ComponentLink1Description: Datasheet; ComponentLink1URL: https://www.seielect.com/catalog/sei-rmcf_rmcp.pdf; ComponentLink2Description: Distributor; ComponentLink2URL: https://www.digikey.com/en/products/detail/stackpole-electronics-inc/RMCF0603ZT0R00/1756908; ComponentLink3Description: Manufacturer; ComponentLink3URL: https://www.seielect.com/; Status: Not Checked; Power Rating: 100mW; DB Parameter 1: 0R; DB Parameter 3: 100mW; Rated Current: 1A
R82 R83 = Res 10k 1% 100mW 0603: Resistor 10k 1% 100mW 0603; Manufacturer: Yageo; Manufacturer Part Number: RC0603FR-1310KL; Temperature Coefficient: ±100 PPM/°C; Production Status: Active; Distributor: Digi-Key; Distributor Part Number: 13-RC0603FR-1310KLCT-ND; Last Revision Date: 26.07.2021; Temperature Range: -55°C ~ +155°C; Mounting: SMD; ComponentLink1Description: Datasheet; ComponentLink1URL: https://www.yageo.com/upload/media/product/productsearch/datasheet/rchip/PYu-RC_Group_51_RoHS_L_11.pdf; ComponentLink2Description: Distributor; ComponentLink2URL: https://www.digikey.com/en/products/detail/yageo/RC0603FR-1310KL/12756399; ComponentLink3Description: Manufacturer; ComponentLink3URL: https://www.yageo.com/en/ProductSearch/PartNumberSearch?part_number=RC0603FR-1310KL; Status: Not Checked; Power Rating: 100mW; Tolerance: ±1%
R84-R87 = Res 120R 1% 125mW 0805 MS: Resistor  120R 125mW 0805; Manufacturer: Panasonic Electronic Components; Manufacturer Part Number: ERJ-P06J121V; Tolerance: ±1%; Production Status: Active; Distributor: Digi-Key; Distributor Part Number: P120ADCT-ND; Last Revision Date: 19.07.2021; Temperature Range: -55°C ~ +155°C; Mounting: SMD; ComponentLink1Description: Datasheet; ComponentLink1URL: https://industrial.panasonic.com/cdbs/www-data/pdf/RDO0000/AOA0000C331.pdf; ComponentLink2Description: Distributor; ComponentLink2URL: https://www.digikey.com/en/products/detail/panasonic-electronic-components/ERJ-P06J121V/525207; ComponentLink3Description: Manufacturer; ComponentLink3URL: https://na.industrial.panasonic.com/products/resistors/smd-chip-resistors/lineup/high-power-anti-surge-high-voltage/series/36033/model/38481; Status: Not Checked; Power Rating: 125mW; DB Parameter 1: 120R; DB Parameter 2: 125mW
SW2 = Mech Switch ADTSM32NV MS: Tactile Switch SPST 0.05A 12VDC; Manufacturer: Apem; DB Parameter 3: 160gf; Production Status: Active; Distributor: Mouser; Distributor Part Number: 642-ADTSM32NV; Manufacturer Part Number: ADTSM32NV; Last Revision Date: 08.06.2021; Mounting: SMD; ComponentLink1Description: Datasheet; ComponentLink1URL: https://eu.mouser.com/datasheet/2/26/apem_appms00429_1-1990767.pdf; ComponentLink2Description: Distributor; ComponentLink2URL: https://eu.mouser.com/ProductDetail/Apem/ADTSM32NV/?qs=iGLABakYCr87MRca7foRyA==; ComponentLink3Description: Manufacturer; Status: Not Checked; Rated Current: 0.05A; Rated Voltage: 12VDC; DB Parameter 1: 0.05A; DB Parameter 2: 12VDC; Operating Force: 160gf
U7 = IC MCU STM32G431C6T6 MS: IC MCU 32BIT 32KB FLASH 48LQFP; Manufacturer: STMicroelectronics; Supply Voltage: 1.71V ~ 3.6V; Production Status: Active; Distributor: Mouser; Distributor Part Number: 511-STM32G431C6T6; Manufacturer Part Number: STM32G431C6T6; Last Revision Date: 21.07.2021; Temperature Range: -40°C ~ +85°C; Mounting: SMD; Status: Not Checked; Flash size: 32kB; Data RAM: 32kB; DB Parameter 1: STM32G431C6T6; ComponentLink1Description: Datasheet; ComponentLink1URL: https://www.st.com/resource/en/datasheet/stm32g431c6.pdf; ComponentLink2Description: Distributor; ComponentLink2URL: https://eu.mouser.com/ProductDetail/STMicroelectronics/STM32G431C6T6?qs=uwxL4vQweFMIHkXLHKxSFQ%3D%3D; ComponentLink3Description: Manufacturer; ComponentLink3URL: https://www.st.com/en/microcontrollers-microprocessors/stm32g431c6.html
U8 = IC ST3232CTR MS: IC TRANSCEIVER RS232 FULL 2/2 16TSSOP; Manufacturer: STMicroelectronics; Power Supply: 3V~5.5V; DB Parameter 1: TPS2410PW; DB Parameter 3: 400kbps; Production Status: Active; Distributor: Digi-Key; Distributor Part Number: 497-6535-1-ND; Last Revision Date: 09.06.2021; Temperature Range: 0°C ~ +70°C; Mounting: SMD; ComponentLink1Description: Datasheet; ComponentLink1URL: https://www.st.com/resource/en/datasheet/st3232c.pdf; ComponentLink2Description: Distributor; ComponentLink2URL: https://www.digikey.com/en/products/detail/stmicroelectronics/ST3232CTR/1039248?s=N4IgTCBcDaIMoBUDMYUGEECUQF0C%2BQA; ComponentLink3Description: Manufacturer; ComponentLink3URL: https://www.st.com/en/interfaces-and-transceivers/st3232c.html; Status: Not Checked; DB Parameter 2: 3V~5.5V; Manufacturer Part Number: ST3232CTR
U9 = IC TCAN337GDCNR MS: CAN Interface IC 3.3-V CAN Transceivers with CAN FD SOT 23-8; Manufacturer: Texas Instruments; Power Supply: 3.0V ~3.6V; Production Status: Active; Distributor: Mouser; Distributor Part Number: 595-TCAN337GDCNR; Last Revision Date: 31.01.2022; Temperature Range: -40°C ~ +125°C; Mounting: SMD; ComponentLink1Description: Datasheet; ComponentLink1URL: https://www.ti.com/lit/ds/symlink/tcan337g.pdf?HQS=dis-mous-null-mousermode-dsf-pf-null-wwe&ts=1643621904746&ref_url=https%253A%252F%252Fru.mouser.com%252F; ComponentLink2Description: Distributor; ComponentLink2URL: https://eu.mouser.com/ProductDetail/Texas-Instruments/TCAN337GDCNR?qs=sGAEpiMZZMsyYdr3R27aV8OesWHw5m0o10FTgWlxXWw%3D; ComponentLink3Description: Manufacturer; ComponentLink3URL: https://www.ti.com/store/ti/en/p/product/?p=TCAN337GDCNR; Status: Not Checked; DB Parameter 1: TCAN337GDCNR; Manufacturer Part Number: TCAN337GDCNR
Y1 = Xtal ABMM2-8.000MHZ-E2-T MS: CRYSTAL 8.0000MHZ 18PF SMD; Manufacturer: ABRACON; Tolerance: ±20ppm; ESR: 50R; Frequency: 8MHz; Distributor: Digi-Key; Distributor Part Number: 535-9628-1-ND; Manufacturer Part Number: ABMM2-8.000MHZ-E2-T; Last Revision Date: 07.06.2021; Temperature Range: -20°C ~ +70°C; Mounting: SMD; ComponentLink1Description: Datasheet; ComponentLink1URL: https://abracon.com/Resonators/ABMM2.pdf; ComponentLink2Description: Distributor; ComponentLink2URL: https://www.digikey.com/en/products/detail/abracon-llc/ABMM2-8-000MHZ-E2-T/1236945?s=N4IgTCBcDaIIICECySwFoAcA6ADHpAEgFpoCi6AKiALoC%2BQA; ComponentLink3Description: Manufacturer; ComponentLink3URL: https://abracon.com/parametric/crystals/ABMM2-8.000MHZ-E2-T; Status: Not Checked; Load Capacitance: 18pF; DB Parameter 1: 8MHz; DB Parameter 2: 18pF; DB Parameter 3: ±20ppm; Frequency Stability: ±20ppm
Y2 = Xtal ABS07-32.768KHZ-T MS: Crystal 32.768K HZ 12.5PF SMD; Manufacturer: Abracon LLC; Tolerance: ±20ppm; Distributor: Digi-Key; Distributor Part Number: 535-9542-1-ND; Manufacturer Part Number: ABS07-32.768KHZ-T; Last Revision Date: 29.07.2021; Temperature Range: -40°C ~ +85°C; Mounting: SMD; ComponentLink1Description: Datasheet; ComponentLink1URL: https://abracon.com/Resonators/ABS07.pdf; ComponentLink2Description: Distributor; ComponentLink2URL: https://www.digikey.at/product-detail/en/abracon-llc/ABS07-32-768KHZ-T/535-9542-1-ND/1237009; ComponentLink3Description: Manufacturer; ComponentLink3URL: https://abracon.com/parametric/crystals/ABS07-32.768KHZ-T; Status: Not Checked; Load Capacitance: 12.5pF; Frequency: 32.768kHz; DB Parameter 1: 32.768kHz; DB Parameter 2: 12.5pF; DB Parameter 3: ±20ppm; Frequency Stability: -